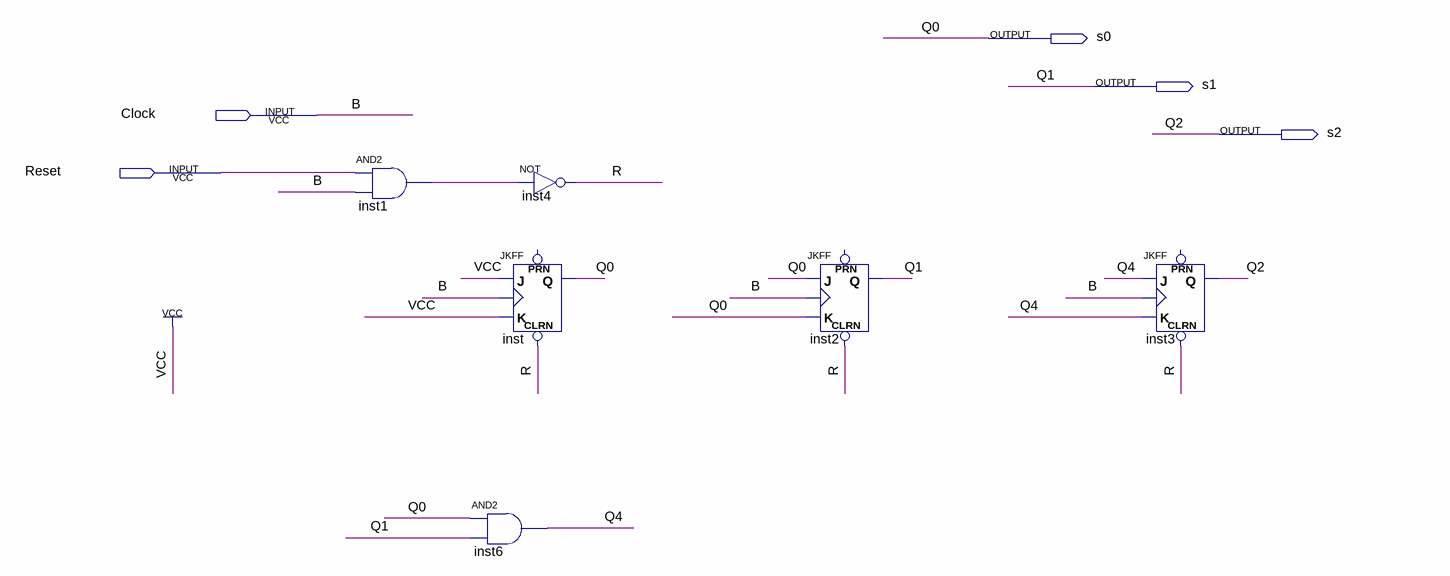
[diagram p0: schematic sheet]
// Quartus schematic ContadorS.bdf as structural Verilog: 6 symbols, 5 pins
module ContadorS (
  input  Clock,
  input  Reset,
  output s0,
  output s1,
  output s2
);

  wire inst1_out, Q4, R;

  and inst1 (inst1_out, Reset, Clock);
  and inst6 (Q4, s0, s1);
  not inst4 (R, inst1_out);
  JKFF inst (.CLRN(R), .K(1'b1), .J(1'b1), .CLK(Clock), .Q(s0));  // open: PRN
  JKFF inst2 (.CLRN(R), .K(s0), .J(s0), .CLK(Clock), .Q(s1));  // open: PRN
  JKFF inst3 (.CLRN(R), .K(Q4), .J(Q4), .CLK(Clock), .Q(s2));  // open: PRN

  // Other names for the same wires on the sheet: B = Clock; Q0 = s0; Q1 = s1; Q2 = s2
endmodule
